# EAGLE board BMS_MCU (EAGLE 7.5.0)
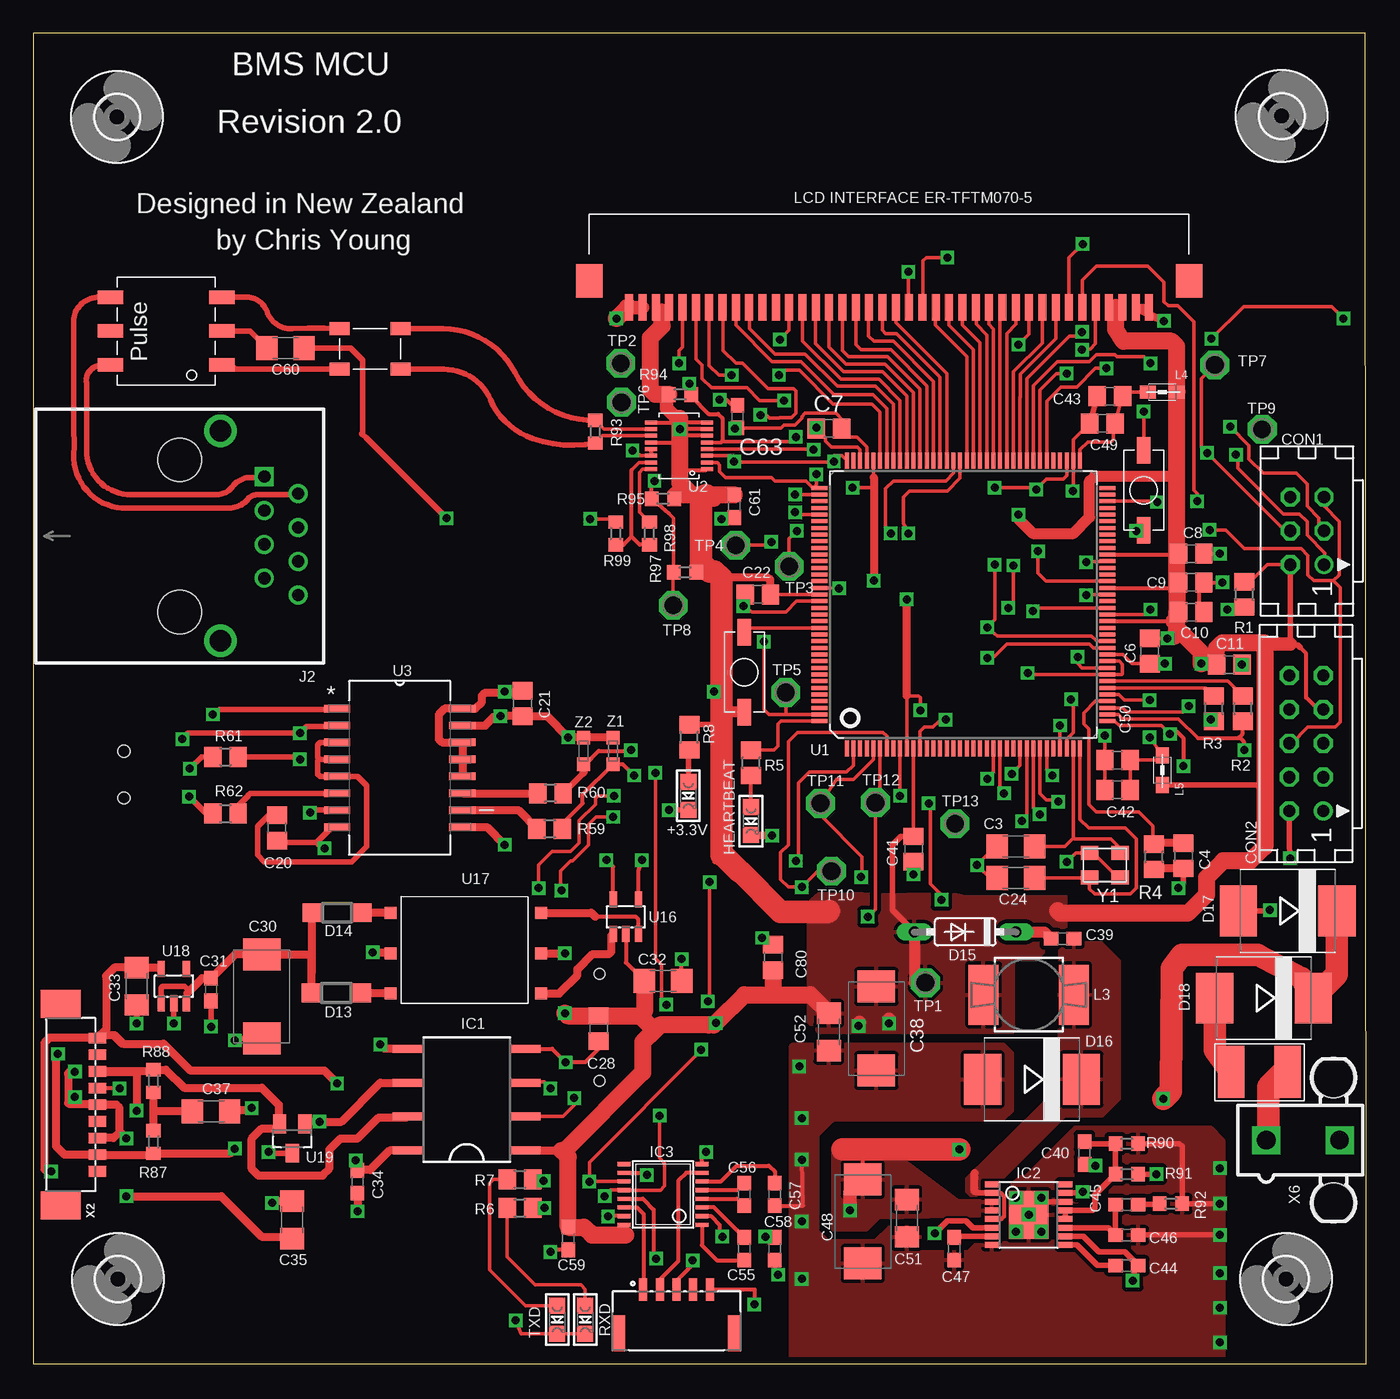
[diagram p2: board, top side]
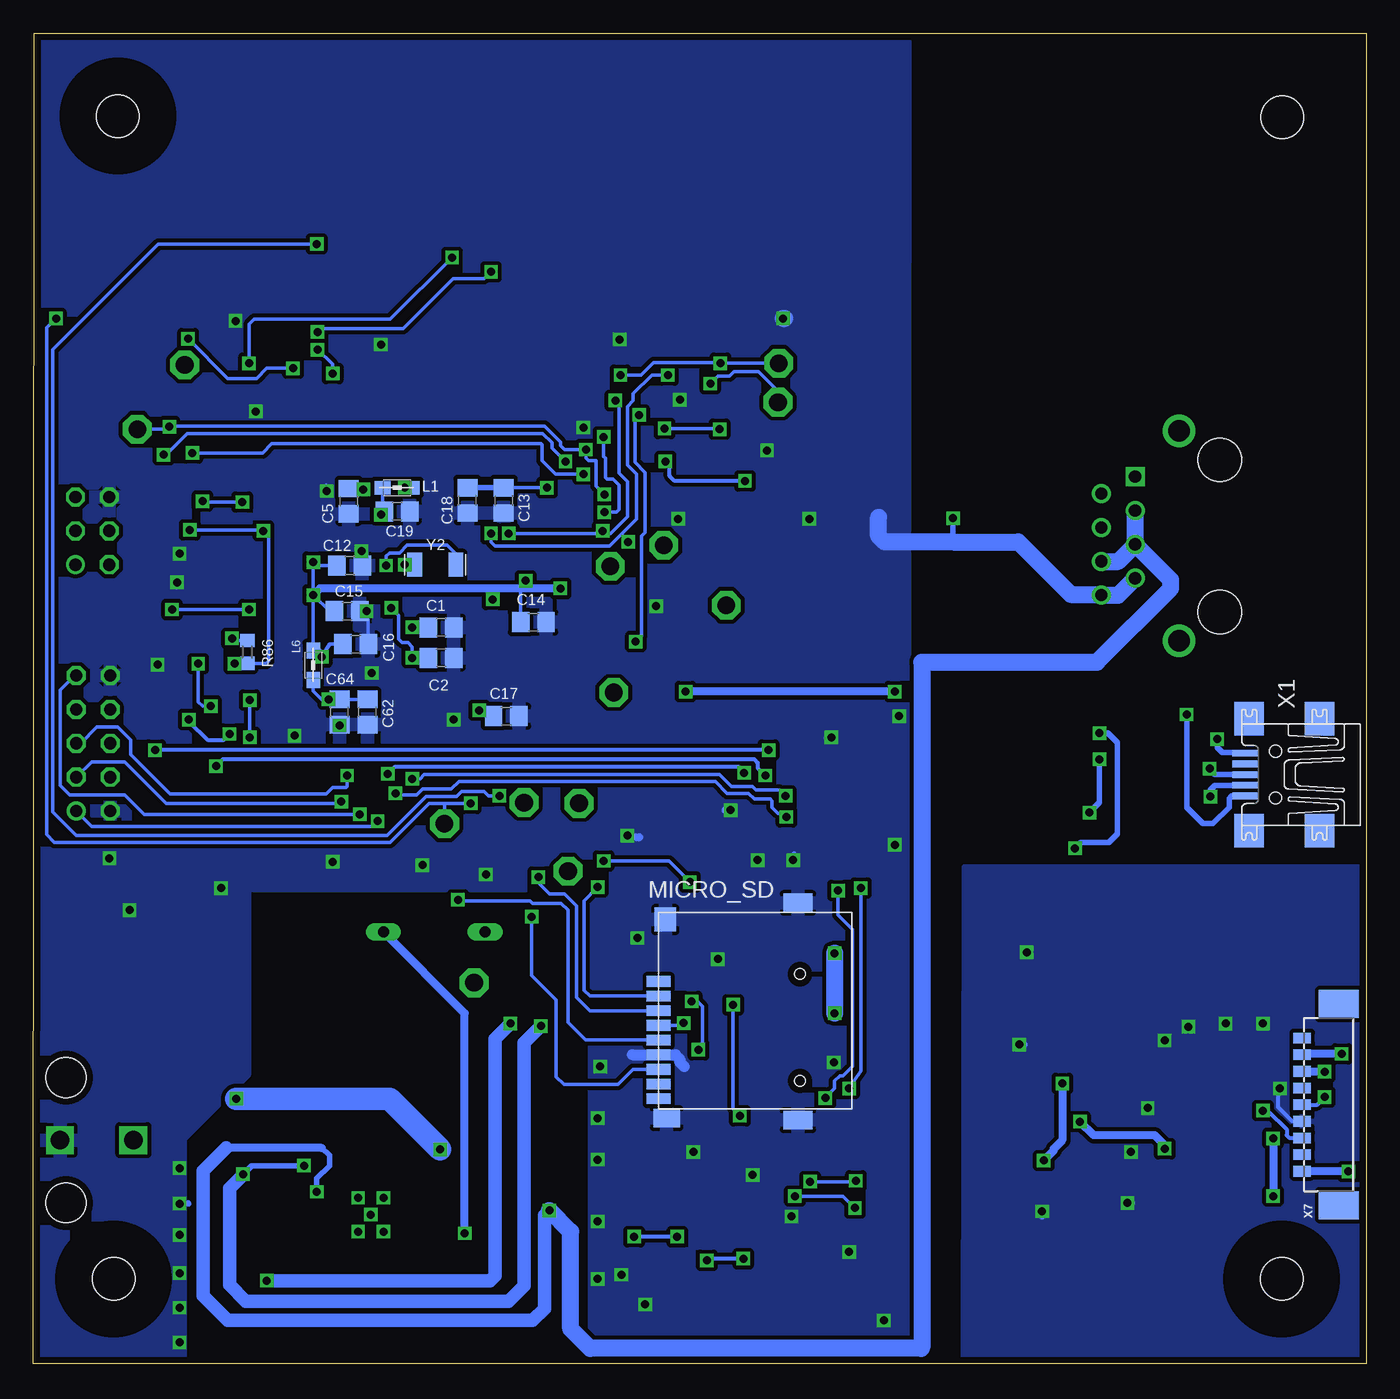
[diagram p3: board, bottom side, seen from below]

Size 100 x 99.81 mm. Coordinates in mm from the lower left corner, seen from the top.
Outline: 0,0 100,0 99.94,99.81 0,99.81 0,0
Copper layers (1*16): Top 0.035mm / dielectric 1.5mm / Bottom 0.035mm
Design rules "default *": minimum track width 6mil, minimum drill 12mil, track to track 6mil, track to pad 6mil, pad to pad 6mil, via to via 6mil, smd to smd 0mil, copper to edge 20mil, drill to drill 8mil, minimum pad ring 10mil, minimum via ring 8mil, stop-mask expansion 4mil, vias tented up to drill 0mil, thermal gap 10mil
Net classes: 0 default: drill 0.305 mm, clearance 0.152 mm; 1 POWER_12V: width 0.254 mm, drill 0.305 mm, clearance 0.152 mm to class 0, clearance 0.152 mm; 2 POWER_5V: width 0.254 mm, drill 0.305 mm, clearance 0.152 mm to class 0, clearance 0.152 mm to class 1, clearance 0.152 mm; 3 Ground: width 0.254 mm, drill 0.305 mm, clearance 0.152 mm to class 0, clearance 0.152 mm to class 1, clearance 0.152 mm to class 2, clearance 0.152 mm; 12 CAN_GND: clearance 0.381 mm to class 0, clearance 0.381 mm to class 1, clearance 0.381 mm to class 2, clearance 0.381 mm to class 3

## Footprints (pad centres in the part's own frame; a part is rotated, then mirrored left to right if it is on the bottom)
CHIPLED_0805 = smd 1.2 x 1.2: A 0,-1.05; C 0,1.05
C0805 = smd 1.3 x 1.5: 1 -0.95,0; 2 0.95,0
C1206 = smd 1.6 x 1.8: 1 -1.4,0; 2 1.4,0
SMC_D = smd 2.4 x 2.8: + -3.15,0; - 3.15,0
C0603 = smd 1.1 x 1: 1 -0.85,0; 2 0.85,0
C1206@1 = smd 1.6 x 1.8: 1 -1.4,0; 2 1.4,0
C0603@1 = smd 1.1 x 1: 1 -0.85,0; 2 0.85,0
CON06 = drill 0.914: 1 -2.54,-1.27 | drill 0.914 octagon: 2 -2.54,1.27; 3 0,-1.27; 4 0,1.27; 5 2.54,-1.27; 6 2.54,1.27
CON10 = drill 0.914: 1 -5.08,-1.27 | drill 0.914 octagon: 2 -5.08,1.27; 3 -2.54,-1.27; 4 -2.54,1.27; 5 0,-1.27; 6 0,1.27; 7 2.54,-1.27; 8 2.54,1.27; 9 5.08,-1.27; 10 5.08,1.27
SOD123 = smd 1.4 x 1.4: A 1.9,0; C -1.9,0
DO35-7 = drill 0.813 long: A 3.81,0; C -3.81,0
SMC = smd 2.8 x 3.8: A 3.7,0; C -3.7,0
PUCHBUTTON = smd 2 x 1: P$1 3,0; P$2 -3,0
1812 = smd 2 x 3.9: P$1 0,-0.03; P$2 4.25,-0.03
3,2 = hole 3.2: 0,0
DUB-R-PDSO-G8 = smd 0.6 x 2.2: 1 -3.81,-4.445; 2 -1.27,-4.445; 3 1.27,-4.445; 4 3.81,-4.445; 5 3.81,4.445; 6 1.27,4.445; 7 -1.27,4.445; 8 -3.81,4.445
TSSOP16EXP = smd 0.45 x 1.05: 1 -2.275,-2.768; 2 -1.625,-2.768; 3 -0.975,-2.768; 4 -0.325,-2.768; 5 0.325,-2.768; 6 0.975,-2.768; 7 1.625,-2.768; 8 2.275,-2.768; 9 2.275,2.768; 10 1.625,2.768; 11 0.975,2.768; 12 0.325,2.768; 13 -0.325,2.768; 14 -0.975,2.768; 15 -1.625,2.768; 16 -2.275,2.768 | smd 3.58 x 2.94: EXP 0,0
TSSOP16 = smd 0.305 x 0.991: 1 -2.275,-2.918; 2 -1.625,-2.918; 3 -0.975,-2.918; 4 -0.325,-2.918; 5 0.325,-2.918; 6 0.975,-2.918; 7 1.625,-2.918; 8 2.275,-2.918; 9 2.275,2.918; 10 1.625,2.918; 11 0.975,2.918; 12 0.325,2.918; 13 -0.325,2.918; 14 -0.975,2.918; 15 -1.625,2.918; 16 -2.275,2.918
J0-C/D/E = drill 0.914 square: 1 4.445,-6.35 | drill 0.914: 2 3.175,-8.89; 3 1.905,-6.35; 4 0.635,-8.89; 5 -0.635,-6.35; 6 -1.905,-8.89; 7 -3.175,-6.35; 8 -4.445,-8.89 | drill 1.626: S1 -7.874,-3.048; S2 7.874,-3.048 | hole 3.251: -5.715,0; 5.715,0
0805 = smd 1.2 x 1: 1 -1.1,0; 2 1.1,0
MS85 = smd 4.5 x 2.25: 1 0,-3.383; 2 0,3.383
MICROSD_PP = smd 1.8 x 0.8: 1 0,3.85; 2 0,2.75; 3 0,1.65; 4 0,0.55; 5 0,-0.55; 6 0,-1.65; 7 0,-2.75; 8 0,-3.85; 9 0,-4.95 | smd 1.6 x 1.8: GND@1 0.5,8.5 | smd 2.2 x 1.4: GND@2 10.45,9.75; GND@4 10.45,-6.55 | smd 2 x 1.4: GND@3 0.6,-6.4 | hole 0.8: 10.6,4.4; 10.6,-3.6
R0805 = smd 1.3 x 1.5: 1 -0.95,0; 2 0.95,0
R0603 = smd 1 x 1.1: 1 -0.85,0; 2 0.85,0
P1-13 = drill 1.321 pad 2.159 octagon: TP 0,0
LQFP144 = smd 0.3 x 1.2: 1 -8.75,-10.8; 2 -8.25,-10.8; 3 -7.75,-10.8; 4 -7.25,-10.8; 5 -6.75,-10.8; 6 -6.25,-10.8; 7 -5.75,-10.8; 8 -5.25,-10.8; 9 -4.75,-10.8; 10 -4.25,-10.8; 11 -3.75,-10.8; 12 -3.25,-10.8; 13 -2.75,-10.8; 14 -2.25,-10.8; 15 -1.75,-10.8; 16 -1.25,-10.8; 17 -0.75,-10.8; 18 -0.25,-10.8; 19 0.25,-10.8; 20 0.75,-10.8; 21 1.25,-10.8; 22 1.75,-10.8; 23 2.25,-10.8; 24 2.75,-10.8; 25 3.25,-10.8; 26 3.75,-10.8; 27 4.25,-10.8; 28 4.75,-10.8; 29 5.25,-10.8; 30 5.75,-10.8; 31 6.25,-10.8; 32 6.75,-10.8; 33 7.25,-10.8; 34 7.75,-10.8; 35 8.25,-10.8; 36 8.75,-10.8; 73 8.75,10.8; 74 8.25,10.8; 75 7.75,10.8; 76 7.25,10.8; 77 6.75,10.8; 78 6.25,10.8; 79 5.75,10.8; 80 5.25,10.8; 81 4.75,10.8; 82 4.25,10.8; 83 3.75,10.8; 84 3.25,10.8; 85 2.75,10.8; 86 2.25,10.8; 87 1.75,10.8; 88 1.25,10.8; 89 0.75,10.8; 90 0.25,10.8; 91 -0.25,10.8; 92 -0.75,10.8; 93 -1.25,10.8; 94 -1.75,10.8; 95 -2.25,10.8; 96 -2.75,10.8; 97 -3.25,10.8; 98 -3.75,10.8; 99 -4.25,10.8; 100 -4.75,10.8; 101 -5.25,10.8; 102 -5.75,10.8; 103 -6.25,10.8; 104 -6.75,10.8; 105 -7.25,10.8; 106 -7.75,10.8; 107 -8.25,10.8; 108 -8.75,10.8 | smd 1.2 x 0.3: 37 10.8,-8.75; 38 10.8,-8.25; 39 10.8,-7.75; 40 10.8,-7.25; 41 10.8,-6.75; 42 10.8,-6.25; 43 10.8,-5.75; 44 10.8,-5.25; 45 10.8,-4.75; 46 10.8,-4.25; 47 10.8,-3.75; 48 10.8,-3.25; 49 10.8,-2.75; 50 10.8,-2.25; 51 10.8,-1.75; 52 10.8,-1.25; 53 10.8,-0.75; 54 10.8,-0.25; 55 10.8,0.25; 56 10.8,0.75; 57 10.8,1.25; 58 10.8,1.75; 59 10.8,2.25; 60 10.8,2.75; 61 10.8,3.25; 62 10.8,3.75; 63 10.8,4.25; 64 10.8,4.75; 65 10.8,5.25; 66 10.8,5.75; 67 10.8,6.25; 68 10.8,6.75; 69 10.8,7.25; 70 10.8,7.75; 71 10.8,8.25; 72 10.8,8.75; 109 -10.8,8.75; 110 -10.8,8.25; 111 -10.8,7.75; 112 -10.8,7.25; 113 -10.8,6.75; 114 -10.8,6.25; 115 -10.8,5.75; 116 -10.8,5.25; 117 -10.8,4.75; 118 -10.8,4.25; 119 -10.8,3.75; 120 -10.8,3.25; 121 -10.8,2.75; 122 -10.8,2.25; 123 -10.8,1.75; 124 -10.8,1.25; 125 -10.8,0.75; 126 -10.8,0.25; 127 -10.8,-0.25; 128 -10.8,-0.75; 129 -10.8,-1.25; 130 -10.8,-1.75; 131 -10.8,-2.25; 132 -10.8,-2.75; 133 -10.8,-3.25; 134 -10.8,-3.75; 135 -10.8,-4.25; 136 -10.8,-4.75; 137 -10.8,-5.25; 138 -10.8,-5.75; 139 -10.8,-6.25; 140 -10.8,-6.75; 141 -10.8,-7.25; 142 -10.8,-7.75; 143 -10.8,-8.25; 144 -10.8,-8.75
MSOP16 = smd 0.305 x 0.889: P$1 0,0; P$2 0.5,0; P$3 1,0; P$4 1.5,0; P$5 2,0; P$6 2.5,0; P$7 3,0; P$8 3.5,0; P$9 3.5,4.2; P$10 3,4.2; P$11 2.5,4.2; P$12 2,4.2; P$13 1.5,4.2; P$14 1,4.2; P$15 0.5,4.2; P$16 0,4.2
SOIC127P1032X265-16N = smd 1.981 x 0.559: 1 -4.699,4.445; 2 -4.699,3.175; 3 -4.699,1.905; 4 -4.699,0.635; 5 -4.699,-0.635; 6 -4.699,-1.905; 7 -4.699,-3.175; 8 -4.699,-4.445; 9 4.699,-4.445; 10 4.699,-3.175; 11 4.699,-1.905; 12 4.699,-0.635; 13 4.699,0.635; 14 4.699,1.905; 15 4.699,3.175; 16 4.699,4.445
SOT23-DBV = smd 0.55 x 1.2: 1 -0.95,-1.3; 2 0,-1.3; 3 0.95,-1.3; 4 0.95,1.3; 5 -0.95,1.3
TSOT23-6_DDC = smd 0.9 x 0.9: 1 -3.03,-5.64; 2 0,-5.64; 3 3.03,-5.65; 4 3.03,5.65; 5 0,5.66; 6 -3.01,5.66
SOT23 = smd 1 x 1.4: 1 -0.95,-1.1; 2 0.95,-1.1; 3 0,1.1
DLW43S = smd 1 x 1.5: P$1 0,0; P$2 0,4.572; P$3 3.048,4.572; P$4 3.048,0
ER-CON40HB-2 = smd 2 x 0.6: P$1 0,0; P$2 0,-1; P$3 0,-2; P$4 0,-3; P$5 0,-4; P$6 0,-5; P$7 0,-6; P$8 0,-7; P$9 0,-8; P$10 0,-9; P$11 0,-10; P$12 0,-11; P$13 0,-12; P$14 0,-13; P$15 0,-14; P$16 0,-15; P$17 0,-16; P$18 0,-17; P$19 0,-18; P$20 0,-19; P$21 0,-20; P$22 0,-21; P$23 0,-22; P$24 0,-23; P$25 0,-24; P$26 0,-25; P$27 0,-26; P$28 0,-27; P$29 0,-28; P$30 0,-29; P$31 0,-30; P$32 0,-31; P$33 0,-32; P$34 0,-33; P$35 0,-34; P$36 0,-35; P$37 0,-36; P$38 0,-37; P$39 0,-38; P$40 0,-39 | smd 2.5 x 2: P$41 2,3; P$42 2,-42
T3001NL = smd 1.016 x 1.905: P$1 0,0; P$2 2.54,0; P$3 5.08,0; P$4 5.08,8.382; P$5 2.54,8.382; P$6 0,8.382
UX60-MB-5ST = smd 2 x 0.5: 1 2.25,1.6; 2 2.25,0.8; 3 2.25,0; 4 2.25,-0.8; 5 2.25,-1.6 | smd 2.2 x 2.5: M1 -3.3,-4.2; M2 -3.3,4.2; M3 2,4.2; M4 2,-4.2 | hole 0.9: 0,-1.75; 0,1.75
PB-53398-09 = smd 0.8 x 1.3: 1 -5,1.25; 2 -3.75,1.25; 3 -2.5,1.25; 4 -1.25,1.25; 5 0,1.25; 6 1.25,1.25; 7 2.5,1.25; 8 3.75,1.25; 9 5,1.25 | smd 2.1 x 3: PAD1 -7.55,-1.5; PAD2 7.55,-1.5
CM-502386-05 = smd 0.6 x 1.7: 1 2.5,-4.55; 2 1.25,-4.55; 3 0,-4.55; 4 -1.25,-4.55; 5 -2.5,-4.55 | smd 1 x 2.7: P1 4.35,-1.25; P2 -4.35,-1.25
5566-2 = drill 1.4 square: 1 0,-2.75; 2 0,2.75 | hole 3: 4.7,2.29; -4.7,2.29
CRYSTAL-3.2-2.5 = smd 1.3 x 1.05: 1 -1.15,-0.925; 2 1.15,-0.925; 3 1.15,0.925; 4 -1.15,0.925
ARDUINO_WIFI_SHIELD_V018_TG_RESONATOR_EPSON_FC_145 = smd 1.1 x 1.8: P$1 -1.55,0; P$2 1.55,0
CT/CN0603 = smd 1 x 1: 1 -1,0; 2 1,0

## Placement (x,y rotation side)
+3.3V  PWR  [CHIPLED_0805]  49.15,42.61 180 top
C1  22p  [C0805]  69.41,55.24 0 bottom
C2  22p  [C0805]  69.41,52.96 0 bottom
C3  22p  [C1206]  73.72,38.8 180 top
C4  22p  [C0805]  86.3,38.1 270 top
C5  0.1u  [C0805]  76.33,64.71 270 bottom
C6  0.01u  [C0805]  83.76,53.47 270 top
C7  10u  [C0805]  59.69,70.17 180 top
C8  0.1u  [C0805]  86.87,60.77 0 top
C9  0.1u  [C0805]  86.87,58.61 0 top
C10  0.1u  [C0805]  86.87,56.39 0 top
C11  0.1u  [C0805]  89.73,52.45 0 top
C12  10u  [C0805]  76.26,59.88 0 bottom
C13  0.1u  [C0805]  64.71,64.77 270 bottom
C14  0.1u  [C0805]  62.48,55.63 0 bottom
C15  0.1u  [C0805]  76.45,56.45 0 bottom
C16  0.1u  [C0805]  75.82,53.98 0 bottom
C17  0.1u  [C0805]  64.52,48.58 0 bottom
C18  0.1u  [C0805]  67.44,64.77 270 bottom
C19  0.1u  [C0805]  72.71,63.94 0 bottom
C20  0.1uF  [C0805]  18.29,40.2 270 top
C21  0.1uF  [C0805]  36.7,49.53 270 top
C22  0.1u  [C0805]  54.36,57.72 180 top
C24  22p  [C1206]  73.72,36.45 180 top
C28  0.1uF  [C0805]  42.42,25.15 270 top
C30  10uF  [SMC_D]  17.14,27.56 270 top
C31  0.1uF  [C0603]  13.34,28.07 270 top
C32  0.1uF  [C1206]  47.24,28.7 0 top
C33  0.1uF  [C1206]  7.75,28.32 270 top
C34  0.1uF  [C0603]  24.32,13.65 270 top
C35  4.7nF 2KV  [C1206]  19.43,10.79 270 top
C37  0.1uF  [C1206]  13.34,18.92 0 top
C38  100uF 10V  [SMC_D]  63.25,25.15 270 top
C39  0.68uF  [C0603]  77.22,31.88 0 top
C40  27pF  [C0603]  78.87,15.81 90 top
C41  0.1u  [C0805]  66.04,38.61 270 top
C42  0.1u  [C0805]  81.34,43.05 180 top
C43  0.1u  [C0805]  80.77,72.58 180 top
C44  0.1uF  [C0603]  82.04,7.37 0 top
C45  4700pF  [C0603]  82.04,11.94 0 top
C46  470pF  [C0603]  82.04,9.65 0 top
C47  1uF  [C0603]  69.09,8.64 270 top
C48  10uF  [SMC_D]  62.23,10.67 270 top
C49  10u  [C0805]  80.2,70.55 180 top
C50  10u  [C0805]  81.34,45.28 180 top
C51  4.7uF  [C1206]  65.53,10.92 270 top
C52  4.7uF  [C1206]  59.69,24.89 270 top
C55  0.1uF  [C0603]  53.34,8.64 90 top
C56  0.1uF  [C0603]  53.34,12.7 90 top
C57  0.1uF  [C0603]  55.63,12.7 270 top
C58  0.1uF  [C0603]  55.63,8.64 270 top
C59  0.1uF  [C0603]  40.13,9.4 270 top
C60  100pF  [C1206@1]  18.92,76.2 0 top
C61  100nF  [C0603@1]  52.58,64.33 270 top
C62  0.1u  [C0805]  74.93,48.9 270 bottom
C63  100nF  [C0603@1]  52.83,71.06 90 top
C64  10u  [C0805]  77.03,48.9 270 bottom
C80  0.1uF  [C0805]  55.5,30.48 90 top
CON1  SPI PROG  [CON06]  95.57,62.48 90 top
CON2  JTAG  [CON10]  95.5,46.55 90 top
D13  MBR0520LT  [SOD123]  22.73,27.81 0 top
D14  MBR0520LT  [SOD123]  22.8,33.85 0 top
D15  1N4148DO35-7  [DO35-7]  69.91,32.38 180 top
D16  MBRS340T3  [SMC]  74.93,21.34 180 top
D17  [SMC]  94.11,33.97 180 top
D18  S3D  [SMC]  92.33,27.43 180 top
ERASE  PUCHBUTTON  [PUCHBUTTON]  53.34,51.88 90 top
F1  LITTLEFUSE_PTC  [1812]  89.85,21.91 0 top
H1  MOUNT-HOLE3.2  [3,2]  93.98,6.35 0 top
H2  MOUNT-HOLE3.2  [3,2]  6.35,6.35 0 top
H3  MOUNT-HOLE3.2  [3,2]  93.66,93.6 0 top
H4  MOUNT-HOLE3.2  [3,2]  6.29,93.54 0 top
HEARTBEAT  HEARTBEAT  [CHIPLED_0805]  53.85,40.7 180 top
IC1  ISO1050DUB  [DUB-R-PDSO-G8]  32.51,19.81 90 top
IC2  LT3434  [TSSOP16EXP]  74.68,11.18 270 top
IC3  MAX3232CUE  [TSSOP16]  47.24,12.7 90 top
J2  J0006D21  [J0-C/D/E]  10.99,62.1 90 top
L1  MH2029-300Y  [0805]  72.71,65.72 0 bottom
L3  33uH  [MS85]  74.68,27.69 90 top
L4  MH2029-300Y  [0805]  84.71,72.9 180 top
L5  MH2029-300Y  [0805]  84.71,44.51 90 top
L6  MH2029-300Y  [0805]  78.99,52.39 270 bottom
MICRO_SD  MICRO_SD  [MICROSD_PP]  53.09,24.83 0 bottom
R1  100k  [R0805]  90.87,57.72 90 top
R2  39R 1%  [R0805]  90.74,49.15 90 top
R3  39R 1%  [R0805]  88.58,49.15 90 top
R4  6k8 1%  [R0805]  84.07,38.04 90 top
R5  402R  [R0805]  53.85,45.09 90 top
R6  1K  [R0805]  36.51,11.68 0 top
R7  1K  [R0805]  36.51,13.84 0 top
R8  1K  [R0805]  49.21,46.99 90 top
R59  24R  [R0805]  38.73,40.13 180 top
R60  24R  [R0805]  38.8,42.8 180 top
R61  24R  [R0805]  14.41,45.53 0 top
R62  24R  [R0805]  14.41,41.27 0 top
R86  100k  [R0603]  83.95,53.4 90 bottom
R87  60R  [R0603]  9.02,16.64 270 top
R88  60R  [R0603]  9.02,21.21 270 top
R90  100K  [R0603]  82.04,16.51 180 top
R91  195K  [R0603]  82.04,14.22 180 top
R92  10K  [R0603]  85.34,12 180 top
R93  120R  [R0603]  42.16,69.91 270 top
R94  4K7  [R0603]  48.51,72.71 180 top
R95  10K  [R0603]  47.24,64.9 0 top
R97  10k  [R0603]  48.9,59.37 0 top
R98  1k21  [R0603]  46.23,62.29 90 top
R99  808r  [R0603]  43.69,62.29 270 top
RESET  PUCHBUTTON  [PUCHBUTTON]  83.31,65.53 90 top
RXD  RX LED  [CHIPLED_0805]  41.4,3.3 180 top
TP1  PTR1PAD1-13  [P1-13]  66.93,28.57 0 top
TP2  PTR1PAD1-13  [P1-13]  44.07,75.06 0 top
TP3  PTR1PAD1-13  [P1-13]  56.71,59.82 0 top
TP4  PTR1PAD1-13  [P1-13]  52.7,61.4 0 top
TP5  PTR1PAD1-13  [P1-13]  56.45,50.36 0 top
TP6  PTR1PAD1-13  [P1-13]  44.13,72.14 0 top
TP7  PTR1PAD1-13  [P1-13]  88.65,74.93 0 top
TP8  PTR1PAD1-13  [P1-13]  48.01,56.9 0 top
TP9  PTR1PAD1-13  [P1-13]  92.2,70.1 0 top
TP10  PTR1PAD1-13  [P1-13]  59.88,36.96 0 top
TP11  PTR1PAD1-13  [P1-13]  59.05,42.04 0 top
TP12  PTR1PAD1-13  [P1-13]  63.18,42.1 0 top
TP13  PTR1PAD1-13  [P1-13]  69.15,40.51 0 top
TXD  TX LED  [CHIPLED_0805]  39.31,3.3 180 top
U1  ATSAM3X8EA-AU  [LQFP144]  69.79,56.96 0 top
U2  LTC6820  [MSOP16]  50.55,67.12 90 top
U3  ADUM4160BRWZ  [SOIC127P1032X265-16N]  27.5,44.7 0 top
U16  SN6501  [SOT23-DBV]  44.45,33.53 0 top
U17  WURTHWURTH  [TSOT23-6_DDC]  32.45,30.8 90 top
U18  TPS76350  [SOT23-DBV]  10.54,28.32 0 top
U19  SM712  [SOT23]  19.43,16.89 180 top
U$1  DLW43SH510XK2  [DLW43S]  22.99,77.66 270 top
U$2  ER-CON40HB-2  [ER-CON40HB-2]  44.7,79.25 90 top
U$4  T3001NL  [T3001NL]  14.16,74.93 90 top
X1  MINI-USB-UX60-MB-5ST  [UX60-MB-5ST]  6.79,44.2 180 bottom
X2  CAN IN  [PB-53398-09]  3.56,19.43 270 top
X5  RS232  [CM-502386-05]  48.26,1.02 180 top
X6  5566-2  [5566-2]  95.25,16.76 270 top
X7  CAN OUT  [PB-53398-09]  3.56,19.43 90 bottom
Y1  12MHz KX-7 20pF  [CRYSTAL-3.2-2.5]  80.39,37.4 0 top
Y2  32.768Khz  [ARDUINO_WIFI_SHIELD_V018_TG_RESONATOR_EPSON_FC_145]  69.85,59.94 0 bottom
Z1  CG0603MLC-05E  [CT/CN0603]  43.5,45.97 90 top
Z2  CG0603MLC-05E  [CT/CN0603]  41.27,45.97 90 top

## Tracks (layer width: path | path; a pad name or v marks a point on that pad's centre or on a via)
+3V3  (via drill 0.6)
  Top 0.254: C41.1 U1.11 | C22.1 58.97,57.72 U1.125 | U1.39 81.73,49.21 82.04,48.9 86.23,48.9 v86.68,49.34 | R1.2 91.31,58.67 92.58,59.94 CON1.2 | C10.1 85.79,56.39 | C6.1 v85.09,54.42 85.43,54.42 85.58,54.57 | 85.79,71.56 85.79,66.55 85.6,66.36 | 50.48,70.1 v48.51,70.1 48.53,70.12 U2.P$7 | v52.64,70.17 52.68,70.21 C63.1 56.11,70.21 56.33,70.42 57.15,70.42 57.66,70.93 57.66,71.06 57.91,71.31 60.2,71.31 60.79,70.72 C7.1 61.27,69.53 61.78,69.53 62.55,68.77 U1.105 | U$2.P$37 81.22,79.25 U$2.P$38 | v51.21,25.56 50.83,25.56 50.67,25.4 | v35.37,50.42 36.64,50.42 C21.1
  Top 0.305: U16.2 44.45,30.1 C32.1 | 44.45,9.65 44.45,10.3 IC3.16 | U2.P$8 48.71,70.62 48.64,70.55 48.51,70.42 | U2.P$7 48.72,70.12 48.51,69.91 | U2.P$6 48.55,69.62 48.51,69.66 | U2.P$9 48.46,70.62 48.51,70.67 | U2.P$12 48.29,69.12 48.51,68.9 | 48.51,67.06 50.48,67.06 U2.P$1 | C10.1 C9.1 C8.1 85.86,60.71 U1.62 | U1.57 85.62,58.21 85.79,58.04 | U1.52 85.58,55.71 85.79,56.13 | 86.55,49.21 v86.68,49.34 | CON2.7 96.39,49.09 95.5,49.97 95.5,53.28 95.06,53.72 | 47.18,78.87 47.32,78.87 U$2.P$4 | 47.12,78.93 47.02,78.93 U$2.P$3 | 50.1,60.07 50.1,59.73 R97.2
  Top 0.406: IC2.10 78.78,9.55 79.95,8.38 81.85,8.38 | 81.85,8.38 81.88,8.38 C44.2 | 81.85,8.38 82.61,7.62 82.61,6.35 v82.49,6.22 | R91.1 v84.26,14.22 | C40.1 79.59,14.96 v79.69,14.86 | 51.16,37.69 51.63,38.16 | 95.06,53.72 94.87,53.91 94.36,53.91 94.3,53.98 CON1.2 | C11.1 | C41.1 65.08,39.56 64.45,38.92 64.45,34.04 D15.A | 47.5,72.54 R94.2 | 48.18,65.17 48.18,64.98 R95.2 | L5.1 92.29,43.41 92.39,43.31 | R8.2 51.63,47.94 51.63,47.88
  Top 0.61: C22.1 55.31,58.8 55.18,58.93 55.12,58.93 55.05,58.99 51.69,58.99 51.63,58.93 | IC1.1 39.62,16 | v51.05,50.42 51.63,50.42 | C21.1 36.58,50.35 33.91,50.35 33.66,50.1 33.66,49.66 33.15,49.15 U3.16 30.86,49.15 30.42,48.7 30.42,46.86 30.67,46.61 U3.14 U3.13 U3.12 | U17.2 v39.88,30.8
  Top 0.813: D15.A 66.1,28.57 66.17,28.51 | C11.1 87.76,52.45 v87.63,52.51 | v73.91,63.69 73.91,63.37 74.99,62.29 78.04,62.29 79.25,63.5 79.25,66.23 79.63,66.61 85.34,66.61 85.6,66.36 | ERASE.P$2 51.86,48.88 51.63,48.64
  Top 1.016: v64.2,25.53 64.2,25.84 | v61.91,25.34 61.91,25.53 61.98,25.59 | 47.5,72.54 47.5,71.69 48.64,70.55 | 94.3,53.98 92.77,53.98 92.39,53.59
  Top 1.27: v39.88,26.29 40.07,26.1 C28.1 45.53,26.1 | 46.61,25.02 46.99,25.4 50.67,25.4 51.05,25.4 v51.21,25.56 53.34,27.69 55.63,27.69 | 46.61,25.02 45.72,24.13 45.72,21.84 39.88,16 39.62,16 40.13,15.49 C59.1 41.31,10.25 41.91,9.65 44.45,9.65 | 45.53,26.1 46.61,25.02 | 45.53,26.1 45.84,26.41 C32.1 | C61.1 50.8,65.17 | 49.19,65.17 48.18,65.17 | 51.05,64.92 50.8,65.17 | 50.8,65.17 50.48,65.17 49.19,65.17 | 49.19,65.17 49.02,65.34 49.02,65.6 48.51,66.1 48.51,67.06 48.51,68.9 48.51,69.66 48.51,69.91 v48.51,70.1 48.51,70.42 48.51,70.67 48.51,70.93 | 51.63,50.42 51.63,50.04 | 55.63,27.69 58.3,27.69 C52.1 | 51.63,38.16 51.69,38.16 | 85.79,56.13 85.79,56.39 85.79,58.04 85.79,71.56 85.79,72.88 L4.1 85.79,72.9 85.79,76.33 85.41,76.71 81.79,76.71 81.22,77.6 81.22,79.25 | v87.63,52.51 87.63,53.34 85.79,55.18 | 85.79,55.18 85.79,55.5 85.58,55.71 | 85.79,55.18 85.79,54.78 85.58,54.57 | C11.1 88.77,53.66 89.22,54.1 92.33,54.1 92.39,54.04 92.39,53.59 92.39,43.31 92.39,38.8 | 92.39,38.8 92.39,38.73 | 92.39,38.8 91.31,37.72 89.28,37.72 88.01,36.45 88.01,35.18 86.61,33.78 77.03,33.78 76.83,33.97 | 47.18,78.87 47.12,78.93 | C80.1 55.5,27.81 55.63,27.69 | R94.2 46.67,72.71 46.29,73.09 46.29,76.96 47.18,77.85 47.18,78.72 47.32,78.87
  Top 1.676: 50.48,65.17 50.1,64.79 50.1,60.07 50.74,59.44 51.12,59.44 51.63,58.93 51.63,50.04 51.63,48.64 51.63,47.88 51.63,38.23 51.69,38.16 | 51.63,38.16 51.75,38.16 53.02,36.89 53.09,36.89 56.07,33.91 59.63,33.91 59.69,33.97
  Bottom 0.254: v86.68,49.34 87.31,49.34 87.63,49.66 v87.63,52.51 | R86.2 84.93,54.25 v85.09,54.42 | L1.1 73.81,64.09 C19.1 | v52.64,70.17 48.58,70.17 v48.51,70.1 | MICRO_SD.4 51.39,25.38 v51.21,25.56
  Bottom 0.406: v79.69,14.86 83.63,14.86 v84.26,14.22
  Bottom 0.61: v35.37,50.42 v51.05,50.42
  Bottom 0.813: 73.81,64.09 73.81,63.8 v73.91,63.69
  Bottom 1.016: v82.49,6.22 65.72,6.22 65.34,6.6 65.34,24.38 v64.2,25.53 | v84.26,14.22 84.26,14.16 85.28,13.14 85.28,5.91 84.07,4.7 64.33,4.7 63.18,5.84 63.18,24.07 v61.91,25.34
  Bottom 1.27: v39.88,30.8 v39.88,26.29
  pour Top (isolate 0.305): 73.53,24.96 73.53,30.29 73.6,30.35 75.25,30.35 77.47,32.58 77.47,34.99 69.98,34.99 69.09,35.18 65.6,35.18 63.31,35.12 61.79,35.24 60.9,35.18 60.39,35.18 58.93,35.24 58.36,34.73 58.29,34.29 58.29,34.16 58.17,34.23 58.17,25.65 58.93,24.89 73.47,24.89
+12V  (via drill 0.6)
  Top 0.305: C48.+ 62.23,16 62.17,16.07
  Top 0.406: IC2.15 78.65,12.8 v78.74,12.89
  Top 1.016: v61.28,11.49 61.28,12.87 C48.+
  Top 1.27: 60.71,16.07 60.52,16.07
  Top 1.676: v84.77,19.88 85.34,20.45 85.41,29.65 86.17,30.67 91.89,30.67 95.12,28.96 D18.C 97.81,29.21 D17.C | v69.47,16.07 62.17,16.07 60.71,16.07
  Bottom 0.406: v78.74,12.89 78.74,13.91 77.79,14.86 77.79,15.62 78.36,16.19
  Bottom 0.61: 78.36,16.19 85.53,16.19 87.19,14.54
  Bottom 1.016: 85.53,16.19 87.25,14.48 87.25,5.08 85.41,3.24 62.55,3.24 61.66,4.13 61.66,11.11 v61.28,11.49
  Bottom 1.27: v61.28,11.49 59.69,9.91 59.69,2.6 58.23,1.14 33.4,1.14 33.34,1.21 33.34,52.64 20.19,52.64 14.67,58.17 14.67,58.8 J2.5 | J2.6 18.61,60.2 J2.5 | J2.5 J2.3
  Bottom 1.676: v84.77,19.88 73.28,19.88 v69.47,16.07
  pour Top: 60.01,15.88 60.01,10.1 62.55,10.1 63.44,10.99 72.9,11.18 72.9,12.19 69.41,12.19 64.39,15.94 60.07,15.94
+12V_UNPROTECTED
  Top 1.676: F1.P$2 94.17,22.28 92.65,20.77 92.65,16.91 X6.1
AVREF  (via drill 0.6)
  Top 0.254: U1.75 77.54,66.61 77.28,66.36 76.01,66.36 v75.25,65.6 75.12,65.72 v72.14,65.72
  Bottom 0.254: v75.25,65.6 76.27,65.6 C5.1 | L1.2 v72.14,65.72
BL_CTRL
  Top 0.254: U1.100 65.04,72.25 63.44,73.85 60.58,73.85 57.72,76.71 57.72,79.23 U$2.P$14
CAN_POWER  (via drill 0.6)
  Top 0.254: 5.46,25.02 5.39,25.02
  Top 0.61: U18.5 9.49,29.72 C33.1 6.1,29.72 5.46,29.08 5.46,25.02 | 4.5,24.51 X2.1 | 6.73,24 6.1,24.64 6.03,24.64 | 6.73,24 9.78,24 11.81,21.97 21.84,21.97 v22.8,21.02 | v24.19,15.24 24.19,14.63 C34.1 24.36,14.54 25.27,14.54 26.73,16 IC1.8 | 5.02,24.64 5.01,24.64 X2.1 | 5.39,25.02 X2.1 | 6.73,24 6.67,24 6.03,24.64 | 6.03,24.64 5.02,24.64 | 5.02,24.64 4.83,24.45 1.21,24.45 0.83,24.07 0.83,14.61 1.02,14.41 v1.33,14.41
  Bottom 0.61: v22.8,21.02 22.8,16.76 23.43,16.13 23.43,16 v24.19,15.24 | v1.33,14.41 4.79,14.41 X7.1
CANRX0  (via drill 0.6)
  Top 0.254: v43.5,41.02 42.23,41.02 41.66,40.45 41.66,38.92 40.45,37.72 40.32,37.72 39.56,36.96 39.56,35.56 v39.62,35.5 | v40.58,19.94 40.58,19.37 39.75,18.54 IC1.2 | U1.24 72.54,43.1 v72.83,42.8
  Bottom 0.254: v43.5,41.02 43.75,41.27 44.13,41.27 44.58,41.72 44.58,42.23 44.7,42.35 45.91,42.35 46.35,42.8 47.94,42.8 48.83,43.69 68.07,43.69 68.64,43.12 70.8,43.12 71.25,42.67 72.71,42.67 v72.83,42.8 | v39.62,35.5 39.62,33.66 38.54,32.58 38.54,22.29 39.24,21.59 39.5,21.59 39.88,21.21 39.88,20.64 v40.58,19.94
CANTX0  (via drill 0.6)
  Top 0.254: U1.23 72.04,44.35 v71.56,43.88 | v43.56,42.61 42.35,42.61 42.16,42.42 42.16,41.97 40.96,40.77 40.96,39.05 40.32,38.42 38.92,38.42 37.91,37.4 v37.91,35.69 | v38.8,20.64 38.35,21.14 37.02,21.14 IC1.3
  Bottom 0.254: v43.56,42.61 44.01,43.05 45.78,43.05 46.04,43.31 47.62,43.31 48.51,44.2 70.67,44.2 70.99,43.88 v71.56,43.88 | v37.91,35.69 37.91,21.97 v38.8,20.64
CTP_INT
  Top 0.254: U1.82 74.04,72.51 74.04,72.52 74.04,74.23 76.7,76.89 U$2.P$33
CTP_RST  (via drill 0.6)
  Top 0.254: U1.79 75.54,73.06 76.77,74.3 v77.53,74.3 | U$2.P$36 79.69,79.24 79.69,76.52 79.31,76.14 78.74,76.14 v78.68,76.07
  Bottom 0.254: v77.53,74.3 77.53,74.99 v78.68,76.07
CTP_SCL  (via drill 0.6)
  Top 0.254: U1.70 84.26,64.71 v84.33,64.64 | v87.31,64.71 87.31,65.28 87.06,65.53 87.06,78.17 85.85,79.38 85.15,79.38 84.84,79.69 84.84,81.15 83.63,82.36 79.76,82.36 78.7,81.31 U$2.P$35
  Bottom 0.254: v84.33,64.64 87.25,64.64 v87.31,64.71
CTP_SDA  (via drill 0.6)
  Top 0.254: U1.9 65.04,43.83 v65.02,42.61 | U$2.P$34 77.7,82.97 v78.74,84.01
  Bottom 0.254: v78.74,84.01 90.61,84.01 98.55,76.07 98.55,41.4 96.77,39.62 73.47,39.62 70.55,42.55 68.26,42.55 67.88,42.93 66.17,42.93 65.85,42.61 v65.02,42.61
CTP_WAKE
  Top 0.254: U$2.P$32 75.69,79.24 75.69,76.58 73.54,74.42 U1.83
D+  (via drill 0.6)
  Top 0.254: 80.57,48.2 81.15,48.2 81.47,47.88 84.64,47.88 v85.28,47.24
  Top 0.305: 80.57,48.2 U1.37 | v45.09,44.13 44.24,44.97 Z1.1 41.21,42.69 41.21,42.04 39.69,40.51 R59.1 | v86.3,44.83 86.3,46.93 85.63,47.59 v85.28,47.24 | R3.1 88.45,48.2 v88.33,48.32
  Bottom 0.305: v86.3,44.83 85.79,45.34 45.91,45.34 45.66,45.09 45.66,44.7 v45.09,44.13 | v88.33,48.32 88.33,48.2 86.93,46.8 85.72,46.8 v85.28,47.24
D-  (via drill 0.6)
  Top 0.254: U1.38 81.4,48.71 81.72,48.39 85.92,48.39 87.38,46.93
  Top 0.305: 90.74,48.01 R2.1 90.74,47.24 90.42,46.93 | Z2.1 41.42,44.97 42.42,45.97 45.09,45.97 v44.83,46.04 | 87.38,46.93 90.42,46.93 | 90.42,46.93 90.55,46.93 90.81,46.67 90.81,46.1 v90.87,46.04
  Top 0.406: R60.1 41.27,44.33
  Top 0.61: Z2.1 41.27,44.33
  Bottom 0.305: v44.83,46.04 v90.87,46.04 90.81,46.1
DB0
  Top 0.254: U1.99 65.54,72.58 63.69,74.42 60.77,74.42 58.67,76.52 58.67,79.22 U$2.P$15
DB1
  Top 0.254: U1.98 66.04,72.84 63.88,74.99 60.96,74.99 59.69,76.26 59.69,79.23 U$2.P$16
DB2
  Top 0.254: U1.97 66.54,73.1 64.07,75.56 61.15,75.56 60.71,76.01 U$2.P$17
DB3
  Top 0.254: U1.96 67.04,73.36 64.33,76.07 62.1,76.07 61.72,76.45 61.72,79.23 U$2.P$18
DB4
  Top 0.254: U1.95 67.54,73.69 64.52,76.71 63.06,76.71 62.67,77.09 62.67,79.22 U$2.P$19
DB5
  Top 0.254: U1.94 68.04,74.01 64.77,77.28 63.94,77.28 63.69,77.53 63.69,79.23 U$2.P$20
DB6
  Top 0.254: U1.93 68.54,74.28 64.71,78.11 U$2.P$21
DB7  (via drill 0.6)
  Top 0.254: U1.81 74.54,73.9 77.72,77.09 78.36,77.09 v78.68,77.41 | v65.66,81.92 65.66,79.29 U$2.P$22
  Bottom 0.254: v65.66,81.92 66.17,81.41 68.52,81.41 72.26,77.66 78.49,77.66 78.49,77.6 v78.68,77.41
DB8  (via drill 0.6)
  Top 0.254: U1.80 75.04,73.39 76.83,75.18 79.25,75.18 79.76,75.69 81.15,75.69 81.28,75.56 83.31,75.56 v83.82,75.06 83.69,75.18 | v68.58,83 66.99,83 66.74,82.74 66.74,79.28 U$2.P$23
  Bottom 0.254: v83.82,75.06 83.82,77.98 83.44,78.36 73.22,78.36 v68.58,83
DB9
  Top 0.254: U1.90 70.04,75.57 67.69,77.92 67.69,79.23 U$2.P$24
DB10
  Top 0.254: U1.89 70.54,76.08 68.71,77.92 U$2.P$25
DB11
  Top 0.254: U1.88 71.04,76.6 69.72,77.92 69.72,79.23 U$2.P$26
DB12
  Top 0.254: U1.87 71.54,77.18 70.74,77.98 70.74,79.21 U$2.P$27
DB13
  Top 0.254: U1.86 72.04,77.63 71.69,77.98 71.69,79.24 U$2.P$28
DB14
  Top 0.254: U1.85 72.54,79.08 U$2.P$29
DB15
  Top 0.254: U1.84 73.04,77.29 73.72,77.98 73.72,79.23 U$2.P$30
ERASE_S
  Top 0.254: U1.130 53.67,55.21 ERASE.P$1
GND  (via drill 0.6)
  Top 0.254: U2.P$14 45.55,68.12 v44.96,68.52 | U1.33 77.04,47.74 77.03,47.75 v77.03,47.88 | C22.2 53.41,56.89 v53.28,56.83 53.91,56.39 56.45,56.39 57.27,57.21 U1.126 | U1.106 62.04,68.58 61.85,68.77 59.88,68.77 59.44,69.22 59.44,69.47 C7.2 58.74,70.68 v58.74,70.23 | C42.2 C50.2 80.39,46.99 v80.39,47.12 | R4.1 84.58,37.09 85.79,37.09 | C24.2 71.75,36.45 v70.8,37.4 72.2,38.8 C3.2 | C41.2 v66.04,36.7 | U1.12 66.54,47.42 66.86,47.75 67.5,47.75 67.94,48.2 68.45,48.2 v68.45,48.32 | RESET.P$1 v83.31,71.44 | v77.98,65.47 78.04,65.98 U1.74 78.04,69.33 C49.2 | RXD.C TXD.C 36.6,2.25 v36.2,3.24 | v74.61,51.82 74.72,51.71 U1.44 81.68,51.71 81.72,51.75 81.72,52.45 81.47,52.71 U1.46 | U1.54 75.25,56.71 v74.99,56.45 | U1.58 75.97,58.71 75.37,59.31 v75.37,60.96 | U$2.P$13 56.7,77.53 v56.01,76.83 | U$2.P$31 74.7,77.24 v73.91,76.45 | C80.2 55.18,31.43 v54.67,31.94 | Y1.2 81.19,36.83 81.03,36.83 79.53,38.33 Y1.4 78.2,38.33 v77.53,37.66
  Top 0.305: U16.5 43.5,37.27 v42.99,37.78 | U16.4 45.4,36.95 v45.66,37.78 | C32.2 v48.64,30.35 | IC3.8 50.16,15.55 v50.48,15.88 | IC3.10 45.87,14.32 v46.04,14.16 | IC1.4 38.92,23.62 v39.94,22.61 41.4,22.61 42.42,23.62 C28.2 | C63.2 52.55,71.78 52.01,72.33 v51.5,72.33 | U2.P$13 U2.P$14 | 44.91,68.56 v44.96,68.52 | R99.1 43.73,63.33 v41.78,63.37 | C61.2 51.54,63.35 v51.63,63.37 | C57.2 57.75,11.85 v57.66,15.3 | C58.2 55.63,6.92 v55.88,6.67 | IC3.15 43.14,11.07 v43.12,11.05 | C59.2 38.97,8.55 v38.8,8.38 | X5.5 54.12,5.57 v54.1,4.45 | v75.63,9.91 v73.72,9.91 74.68,10.86 IC2.EXP | v73.72,12.45 v75.63,12.45 75.63,12.17 75.65,12.15 | C8.2 v89.03,60.77 | C9.2 v89.22,58.61 | C10.2 87.5,56.71 87.5,58.29 C9.2 | 87.72,58.71 C9.2 | C11.2 90.67,52.32 C11.2
  Top 0.406: IC2.14 75.65,12.15 IC2.EXP | C46.2 v89.03,9.65 | v89.03,12 R92.1 86.19,16.3 85.98,16.51 R90.1 | CON2.2 94.23,38.8 v94.3,37.91 | D17.A 92.71,33.97 v92.77,34.04 | C4.2 86.3,36.07 v85.92,35.69 | C43.2 C49.2 | +3.3V.C 48.13,41.56 v47.69,41.53 | 24.64,69.79 24.7,69.72 | v30.99,63.44 24.96,69.47 24.7,69.72 | C60.2 23.81,76.2 24.7,75.31 24.7,69.72
  Top 0.61: U3.9 34.04,40.26 v35.37,38.92 | U3.15 33.91,47.88 34.61,48.58 v35.05,48.58 C21.2 38.55,48.58 v40.13,46.99 40.15,46.97 Z2.2 Z1.2 | HEARTBEAT.C 54.2,39.65 v55.44,39.62 | C4.2 84.64,37.15 84.58,37.09 | U$2.P$40 U$2.P$39 v84.84,78.23
  Top 1.016: U$2.P$2 U$2.P$1
  Top 1.27: U$2.P$1 44.58,79.25 v43.75,78.42
  Bottom 0.254: v77.03,47.88 77.03,48.01 | v53.28,56.83 53.47,56.71 | v80.39,47.12 80.39,47.05 | v70.8,37.4 70.67,37.4 | v66.04,36.7 66.04,36.64 65.98,36.58 | v68.45,48.32 68.45,48.45 | C16.2 74.87,55.82 C15.2 v74.99,56.45 | v83.31,71.44 83.12,71.44 | v77.98,65.47 78.04,65.91 | v74.61,51.82 74.61,51.88 | v75.37,60.96 75.37,59.94 C12.2 | v56.01,76.83 56.01,76.71 | v73.91,76.45 73.85,76.52 | 55.05,23.18 55.12,23.11 | v54.67,31.94 54.67,32.13 | v77.53,37.66 77.41,37.66
  Bottom 0.305: v42.99,37.78 42.99,38.23 42.93,38.29 | v45.66,37.78 45.72,37.66 | v48.64,30.35 48.64,30.48 48.58,30.54 | v50.48,15.88 50.48,16 50.42,16.07 | v46.04,14.16 46.1,14.16 46.16,14.1 | v39.94,22.61 40.01,22.61 | v51.5,72.33 51.5,72.2 | v44.96,68.52 45.21,68.33 | v51.63,63.37 51.69,63.37 | v57.66,15.3 57.72,15.11 | v55.88,6.67 55.88,6.54 | v43.12,11.05 42.99,11.05 | v38.8,8.38 38.48,8.38 | v54.1,4.45 54.1,4.32 54.17,4.25 | v89.03,60.77 89.09,60.77 | v89.22,58.61 89.28,58.23 | C11.2 90.68,52.51 90.74,52.51
  Bottom 0.406: v89.03,9.65 89.09,9.53 89.03,9.59 | v89.03,12 88.33,12 88.39,12.06 | v94.3,37.91 94.3,37.97 | v85.92,35.69 85.92,35.5 | v47.69,41.53 47.5,41.53 47.94,41.59 48.13,41.59 48.13,41.47 | v30.99,63.44 30.99,61.66
  Bottom 0.61: v35.37,38.92 35.5,38.92 35.56,38.99 | v35.05,48.58 35.18,48.58 35.24,48.51 | v40.13,46.99 40.32,46.99 40.39,46.93 | v55.44,39.62 54.55,39.5
  Bottom 0.813: 51.18,22.29 51.5,22.61 51.5,22.86 51.82,23.18 MICRO_SD.6 55.05,23.18
  Bottom 1.27: v43.75,78.42 43.62,78.42 | 36.58,63.5 36.58,62.1 36.13,61.66 30.99,61.66 26.1,61.66 22.16,57.72 19.94,57.72 J2.8 18.61,57.66 J2.7
  other vias: 74.68,11.18 57.66,6.35 57.66,10.67 57.66,18.41 57.47,22.29 89.03,14.67 89.03,1.59 89.03,6.79 89.03,4.19 90.68,52.45
  pour Bottom (isolate 0.305): 34.73,0 34.61,99.12 99.95,99.19 99.95,0.19 88.96,0.19 88.96,16.95 84.14,21.78 84.14,35.88 59.44,35.88 57.91,34.35 57.91,0
  pour Top (isolate 0.305, rank 2): 58.67,23.94 72.77,23.94 73.41,23.3 73.41,18.99 72.71,18.29 60.01,18.29 58.8,17.08 58.8,9.97 59.56,9.21 63.18,9.21 64.26,10.29 66.17,10.29 66.48,9.97 66.48,8.57 66.67,8.38 70.17,8.38 70.8,9.02 72.83,9.02 73.03,9.21 73.03,10.29 73.47,10.73 73.47,13.46 74.04,14.03 74.49,14.03 78.17,17.72 88.33,17.72 89.28,16.76 89.28,0 57.28,0 56.83,0 56.83,23.75 56.9,23.81 56.9,23.88 56.96,23.94
GNDIO  (via drill 0.6)
  Top 0.254: 4.79,20.7 X2.4 4.72,20.77
  Top 0.305: v6.48,20.64 4.85,20.64 X2.4
  Top 0.406: C33.2 v7.75,25.53 | U18.2 v10.54,25.53 | C31.2 v13.34,25.27 | C30.- 15.52,24.41 15.37,24.26 v15.11,24.26 | C37.2 14.73,19.05 | U19.3 17.74,15.79 v17.65,15.88
  Top 0.61: C35.1 18.04,12.2 v17.91,12.06 | 14.73,19.05 16.26,19.05 v16.38,19.18 | IC1.5 26.35,23.62 v26.04,23.94 | C34.2 v24.32,11.43 | v25.46,30.86 26.73,30.86 U17.5
  Bottom 0.305: X7.4 5.54,18.18 6.6,19.24 6.6,20.51 v6.48,20.64
  Bottom 0.406: v7.75,25.53 7.75,25.27 | v13.34,25.27 13.34,25.02 | v15.11,24.26 14.86,24.26 | v17.65,15.88 17.4,15.88
  Bottom 0.61: v17.91,12.06 17.65,12.06 | v25.46,30.86 25.27,30.86 | v26.04,23.94 25.72,23.94 | v24.32,11.43 24.32,11.11
  pour Bottom (isolate 0.305): 0.06,37.27 30.16,37.27 30.23,0 0,0
HEARTBEAT
  Top 0.254: U1.144 56.08,48.21 55.88,48.01 55.88,46.35 55.56,46.04 R5.2
INT
  Top 0.254: U1.101 64.54,71.99 63.18,73.34 60.33,73.34 57.91,75.75 55.63,75.75 53.72,77.66 53.72,79.23 U$2.P$10
LCD_CS  (via drill 0.6)
  Top 0.254: U1.103 63.54,71.4 62.93,72.01 60.01,72.01 57.47,74.55 56.33,74.55 v55.94,74.17 | v48.45,75.06 48.45,76.01 48.7,76.26 U$2.P$5
  Bottom 0.254: v55.94,74.17 54.42,74.17 53.47,75.12 48.51,75.12 v48.45,75.06 TP2.TP
LTC6820_ENABLE  (via drill 0.6)
  Top 0.254: U2.P$5 51.63,69.12 51.69,69.18 | 51.69,69.25 51.69,69.18 | 51.69,69.18 56.86,69.18 v57.21,69.53 | U1.113 57.15,63.71 v57.15,63.88 | v49.21,73.53 49.34,72.99 R94.1
  Top 0.305: R94.1 49.36,72.56 50.67,71.25 51.37,71.25 51.69,70.93 51.69,69.25
  Bottom 0.254: v57.21,69.53 57.21,68.07 57.09,67.94 57.09,66.48 56.96,66.36 56.52,66.36 56.07,65.91 56.07,64.07 56.26,63.88 v57.15,63.88 | TP6.TP 44.13,72.96 45.59,74.42 47.43,74.42 47.75,74.11 48.64,74.11 v49.21,73.53
MASTER-RESET  (via drill 0.6)
  Top 0.254: U1.47 81.73,53.21 82.42,52.51 83.88,52.51 C6.2 83.89,52.51 v84.9,52.51 | CON1.5 96.84,64.33 97.98,63.18 97.98,59.18 97.54,58.74 | 97.54,58.74 96.08,58.74 95.63,59.18 95.63,60.64 95.12,61.15 90.87,61.15 89.47,62.55 v88.27,62.55 | RESET.P$2 82.79,62.53 v82.74,62.48 | CON2.6 94.42,46.55 95.63,47.75 97.66,47.75 98.04,48.13 98.04,58.23 97.54,58.74
  Bottom 0.254: R86.1 84.86,52.55 v84.9,52.51 82.55,52.51 82.36,52.7 82.36,62.1 v82.74,62.48 82.8,62.55 v88.27,62.55
MISO  (via drill 0.6)
  Top 0.254: U2.P$3 52.34,68.12 52.39,68.07 52.39,67.75 52.51,67.75 v52.58,67.69 | v90.23,68.2 90.36,68.07 90.36,67.18 93.79,63.75 95,63.75 95.57,63.18 95.57,62.17 96.9,60.83 96.9,60.01 CON1.1 | 47.69,63.79 48.05,63.44 R97.1 48.01,59.33 TP8.TP | v52.58,67.69 52.58,68.07 52.51,68.14 | U1.108 60.66,68.14 60.07,68.14 v60.07,67.69 60.01,67.69 59.94,67.63 52.64,67.63 v52.58,67.69
  Top 0.305: v46.61,66.23 46.39,66.02 R95.1 47.69,63.79
  Bottom 0.254: v90.23,68.2 90.04,68.2 88.46,69.79 61.78,69.79 61.09,69.09 61.09,68.71 v60.07,67.69
  Bottom 0.305: v46.61,66.23 51.88,66.23 52.26,66.61 52.26,67.69 v52.58,67.69
MISO1  (via drill 0.6)
  Top 0.254: U1.6 63.54,42.84 TP12.TP 63.18,34.1 v62.61,33.53
  Bottom 0.254: v62.61,33.53 62.61,29.15 60.77,27.3 60.77,21.53 60.2,20.95 56.13,20.95 55.01,22.08 MICRO_SD.7
MOSI  (via drill 0.6)
  Top 0.254: U2.P$2 51.32,67.62 51.5,67.44 51.5,66.93 51.94,66.48 55.37,66.48 55.63,66.23 57.96,66.23 58.48,65.71 | U1.109 58.48,65.71 | CON1.4 93.92,62.48 v88.08,68.33 87.63,68.77 87.63,73.91 TP7.TP | v58.74,66.74 58.74,65.96 58.48,65.71
  Bottom 0.254: v88.08,68.33 82.8,68.33 82.11,69.03 61.91,69.03 61.85,68.96 61.85,67.75 60.83,66.74 v58.74,66.74
MOSI1  (via drill 0.6)
  Top 0.254: U1.5 63.04,45.32 61.53,43.81 60.26,43.81 TP11.TP 59.12,42.55 59.12,41.08 62.17,38.04 62.17,36.58 v62.1,36.51
  Bottom 0.254: v62.1,36.51 62.1,36.07 61.28,35.24 60.13,35.24 59.24,34.35 59.24,27.5 58.23,26.48 MICRO_SD.3
N$1
  Top 0.406: U$4.P$1 14.86,74.93 15.18,74.61 U$1.P$4
N$2
  Top 0.406: U$4.P$3 16,80.01 arc-71 17.53,78.93 arc74 19.43,77.66 arc-6 U$1.P$1
N$3
  Top 0.406: R8.1 49.15,46.04 +3.3V.A
N$4
  Top 0.406: U$4.P$4 4.95,80.01 arc103 3.05,77.85 | 3.05,77.85 3.05,69.79 arc-5 3.05,68.26 arc89 6.67,64.2 14.67,64.2 arc49 16.07,64.83 arc-45 16.83,65.22 19.81,65.22 J2.2 | 3.05,77.85 3.05,77.92
N$5
  Top 0.406: U$4.P$6 4.95,74.87 arc97 4,73.6 4,68.52 arc85 7.05,65.22 13.78,65.22 arc53 14.92,65.79 arc-59 16.51,66.48 17.27,66.48 J2.1
N$7
  Top 0.305: HEARTBEAT.A R5.1
N$8
  Top 0.406: C20.1 17.65,41.15 16.83,40.32 16.83,38.16 17.34,37.66 23.88,37.66 25.02,38.8 25.02,43.37 24.32,44.07 U3.5 21.53,44.07 21.4,44.2 21.34,44.2 21.34,45.21 21.46,45.34 | U3.3 21.53,46.61 21.34,46.42 21.34,45.47 21.46,45.34 | 21.46,45.34 U3.4
N$9
  Top 0.61: U17.1 39.45,27.77 40.83,29.15 40.83,29.59 41.97,30.73 43.18,30.73 43.37,30.92 43.37,32.1 U16.1
N$10
  Top 0.61: D13.A 26.76,27.81 U17.6
N$11
  Top 0.406: R62.2 15.36,41.84 16.13,42.61 16.13,42.67 16.26,42.8 U3.6
N$12  (via drill 0.6)
  Top 0.406: R61.2 19.81,45.53 v20,45.34 | v20.77,41.34 20.77,41.47 20.83,41.53 U3.7
  Bottom 0.406: v20,45.34 20,42.1 v20.77,41.34
N$13
  Top 0.254: RXD.A 41.4,5.59 41.08,5.91 37.66,5.91 35.56,8 R6.1
N$14
  Top 0.254: TXD.A 36.92,4.35 34.23,7.05 34.23,13.53 34.54,13.84 R7.1
N$26
  Top 0.406: 11.56,27.81 11.56,27.09 U18.3 | U18.1 9.59,28.2 9.72,28.32 11.37,28.32 11.72,27.97
  Top 0.61: 11.56,27.81 11.72,27.97 12.66,28.92 C31.1 15.13,30.71 C30.+ 20.86,30.71 D13.C 20.9,30.67 D14.C
N$29
  Top 0.61: D14.A 26.78,33.85 U17.4
N$42
  Top 0.61: U3.10 36.39,41.53 R59.2
N$45
  Top 0.61: U3.11 R60.2
N$47
  Top 0.254: U2.P$11 42.72,69.62 R93.2
  Top 0.406: U$1.P$3 30.8,74.61 arc-66 34.29,72.33 arc48 37.47,69.41 arc29 R93.2
  Top 0.61: R93.2 41.81,69.06
N$53
  Top 0.254: U1.43 89.63,51.21 R2.2
N$54  (via drill 0.6)
  Top 0.61: v15.11,16.13 14.77,15.79 R87.2 8.91,15.68 X2.8 2.35,15.68 1.71,16.32 1.71,23.11 v1.84,23.24 | U19.1 20.55,18.16 v21.46,18.16 23.11,18.16 26.04,21.08 IC1.6
  Bottom 0.61: v15.11,16.13 15.11,16.38 15.88,17.14 20.45,17.14 v21.46,18.16 | v1.84,23.24 4.75,23.24 X7.8
N$55  (via drill 0.6)
  Top 0.254: 4.78,21.91 X2.3
  Top 0.61: IC1.7 28,18.48 25.91,18.48 24.32,16.89 23.05,16.89 22.23,16.07 22.23,14.67 21.72,14.16 21.72,14.1 16.89,14.1 16.38,14.61 16.38,16.89 17.14,17.65 18.14,17.65 U19.2 18.41,18.06 18.41,19.43 17.14,20.7 11.3,20.7 9.95,22.06 R88.1 8.89,21.93 X2.3 | 4.78,21.91 7.62,21.91 7.75,21.78 v7.75,18.99
  Bottom 0.305: v7.75,18.99 7.37,18.99 5.97,17.59 5.97,17.14 5.78,16.95 4.83,16.95 X7.3
N$56
  Top 0.254: U1.42 87.97,50.71 R3.2
N$59  (via drill 0.6)
  Top 0.254: U1.53 83.45,56.21 v83.82,56.58 | v89.6,56.58 90.67,56.58 R1.1
  Bottom 0.254: v83.82,56.58 v89.6,56.58
N$61
  Top 0.406: IC2.12 IC2.13 79.45,11.5 79.63,11.68 79.63,12.66 R91.2 R90.2 79.02,16.51 C40.2
N$62
  Top 0.305: IC3.1 50.16,8.89 51.31,7.75 53.3,7.75 C55.1
N$63
  Top 0.305: C55.2 53.32,9.49 51.05,11.75 50.18,11.75 IC3.3
N$73
  Top 0.305: IC3.4 52.81,12.38 C56.1
N$108
  Top 0.254: U2.P$10 42.81,70.12 R93.1
  Top 0.406: 42.14,70.74 R93.1 arc-64 36.13,74.36 arc63 30.73,77.66 U$1.P$2
N$114
  Top 0.406: 17.46,76.26 C60.1 16.25,77.47 U$4.P$2
N$115
  Top 0.305: IC3.5 52.81,13.03 C56.2
N$118
  Top 0.305: U16.3 45.4,33.34 45.21,33.53 42.16,33.53
  Top 0.61: U17.3 41.86,33.83 42.16,33.53
N$128
  Top 0.305: IC3.6 51.58,13.68 52.77,14.86 55.18,14.86 55.63,14.41 C57.1
N$129
  Top 0.61: R87.1 9.02,18.92 | 9.02,18.92 R88.2 | C37.1 9.02,18.92
N$130  (via drill 0.6)
  Top 0.406: IC2.6 70.51,10.2 69.98,10.73 68.58,10.73 v67.63,9.78
  Top 0.813: D15.C 75.86,32.38 C39.1
  Bottom 0.61: v67.63,9.78 67.63,26.29 D15.C
N$131
  Top 0.406: IC2.9 78.28,8.9 79.82,7.37 C44.1
N$132
  Top 0.305: IC2.2 72.61,12.8 72.83,12.57 72.83,11.05 72.64,10.86 IC2.5
  Top 0.406: IC2.2 70.77,12.8 70.61,12.95
  Top 0.61: 70.61,12.95 70.61,14.29
  pour Top (rank 2): 70.04,12.89 70.04,13.91 76.96,20.64 77.03,30.99 77.72,31.56 80.14,31.56 81.47,30.23 81.47,19.88 80.2,18.61 77.41,18.61 72.83,14.03 71.18,14.03 70.93,13.78 70.93,12.83 70.74,12.64 70.29,12.64
N$133
  Top 0.406: IC2.7 69.15,9.55 C47.1
N$134
  Top 0.406: C45.1 C46.1 80.64,10.2 IC2.11
N$135
  Top 0.406: C45.2 84.43,11.94 R92.2
N$136
  Top 1.676: D18.A 88.63,23.55 F1.P$1
N$137
  Top 0.305: IC3.14 45.3,11.72 45.78,11.24 45.78,5.08 X5.1
N$138
  Top 0.305: IC3.7 49,14.32 48.39,13.72 48.39,7.68 46.99,6.29 46.99,5.08 X5.2
N$139  (via drill 0.6)
  Top 0.305: IC3.13 45.73,12.38 46.55,11.56 46.55,8.06 v46.74,7.87 | v49.47,7.75 49.47,7.43 48.26,6.22 X5.3
  Bottom 0.305: v46.74,7.87 49.34,7.87 v49.47,7.75
N$147  (via drill 0.6)
  Top 0.305: IC3.2 50.84,11.07 51.5,10.41 51.5,9.72 v51.69,9.53 | v54.93,9.53 55.59,9.53 C58.1
  Bottom 0.305: v51.69,9.53 v54.93,9.53
N$150
  Top 0.254: U2.P$15 45.46,67.62 44.9,67.06
  Top 0.305: R99.2 44.3,61.44 44.9,62.04 | 44.9,62.04 44.9,67.06 | R98.1 45.49,61.44 44.9,62.04
N$151
  Top 0.254: U2.P$16 45.72,67.12 45.47,66.86 45.47,63.91 R98.2
  Top 0.305: U2.P$16 46.16,67.12
PE  (via drill 0.6)
  Top 0.254: 4.72,17.02 X2.7
  Top 0.305: X7.5 3.17,19.43 3.11,19.49 v3.11,20
  Top 0.61: 6.48,17.4 6.01,16.93 X2.7 | 6.48,17.4 6.48,19.18 6.22,19.43 X7.5 4.74,19.49 3.11,19.49 2.67,19.49 2.6,19.56 2.6,21.78 2.73,21.91 v3.11,21.91 | 6.48,17.4 v6.99,16.89 | v6.99,12.57 14.1,12.57 17.14,9.53 19.3,9.53 C35.2
  Bottom 0.305: X7.5 3.68,19.43 v3.11,20
  Bottom 0.61: v6.99,16.89 v6.99,12.57 | X7.7 3.13,21.93 v3.11,21.91
RX0  (via drill 0.6)
  Top 0.254: v42.86,12.57 43.31,13.03 IC3.12 47.05,13.02 47.37,13.34 47.37,15.05 46.99,15.43 v46.99,18.61 | v38.35,11.68 R6.2 | U1.27 74.04,44.89 v73.41,44.26 | v46.67,44.32 46.67,30.42 47.12,29.97 47.12,27.11 v47.5,26.92
  Bottom 0.254: v42.86,12.57 39.24,12.57 v38.35,11.68 | v47.5,26.92 47.5,19.11 v46.99,18.61
  Bottom 0.305: v46.67,44.32 46.67,44.39 47.05,44.77 72.9,44.77 v73.41,44.26
SCLK  (via drill 0.6)
  Top 0.254: U2.P$4 58.51,68.62 v58.55,68.58 | v89.79,70.29 91.19,68.9 91.19,67.88 92.27,66.8 94.74,66.8 95.57,65.98 95.57,64.33 96.46,63.44 96.46,62.87 CON1.3 | v57.15,65.22 U1.110
  Bottom 0.254: v57.15,65.22 57.78,65.85 57.78,67.75 58.36,67.75 58.55,67.94 v58.55,68.58 | v58.55,68.58 58.55,68.14 | v58.55,68.58 60.13,68.58 60.45,68.9 60.45,69.15 61.66,70.36 89.72,70.36 v89.79,70.29 89.98,70.1 TP9.TP
SCLK1  (via drill 0.6)
  Top 0.254: U1.78 76.04,72.23 77.09,73.28 78.3,73.28 79.69,74.68 v80.52,74.68 | v88.39,76.9 90.81,79.31 97.41,79.31 v98.3,78.42 | v68.14,34.8 68.14,35.18 67.31,36.01 67.31,41.91 v67.18,42.04
  Bottom 0.254: v80.52,74.68 82.49,74.68 83.25,73.91 85.41,73.91 v88.39,76.9 | MICRO_SD.5 58.57,24.28 59.88,25.59 59.88,34.04 60.39,34.54 62.55,34.54 62.74,34.73 68.07,34.73 v68.14,34.8 | v98.3,78.42 99,77.72 99,39.69 98.42,39.12 73.22,39.12 70.29,42.04 69.15,42.04 | v67.18,42.04 69.15,42.04 | TP13.TP 69.15,42.04
SPI1_CS  (via drill 0.6)
  Top 0.254: U1.7 64.04,47.09 63.75,47.37 57.34,47.37 56.64,46.67 56.64,38.92 56.07,38.35 56.07,36.32 56.64,35.75 v57.66,35.75 58.86,36.96 TP10.TP
  Bottom 0.254: MICRO_SD.2 58.25,27.58 58.67,28 58.67,34.73 v57.66,35.75
SPI2_MISO  (via drill 0.6)
  Top 0.254: U1.91 69.54,66.42 68.58,65.47 65.72,65.47 65.28,65.02 65.28,63.06 v65.66,62.29 | U$2.P$7 50.7,74.9 51.44,74.17 v52.39,74.17 | TP4.TP 55.12,61.4 v55.37,61.66
  Bottom 0.254: v65.66,62.29 65.66,61.66 65.34,61.34 56.77,61.34 55.88,62.23 | 55.88,62.23 54.74,63.37 54.74,66.74 55.44,67.44 55.44,71.82 54.99,72.26 54.99,72.77 53.59,74.17 v52.39,74.17 | v55.37,61.66 55.37,61.72 55.88,62.23
SPI2_MOSI  (via drill 0.6)
  Top 0.254: U1.92 69.04,66.81 68.45,66.23 64.52,66.23 63.94,65.66 63.94,62.74 v64.33,62.29 | U$2.P$6 49.72,79.23 49.72,75.37 50.16,74.93 50.16,73.91 50.86,73.22 53.53,73.22 54.48,72.26 v56.33,72.26 | TP3.TP 56.71,61.91 v57.28,62.48
  Bottom 0.254: v64.33,62.29 57.09,62.29 | v56.33,72.26 56.07,72.01 56.07,66.8 55.44,66.17 55.44,63.56 56.71,62.29 57.09,62.29 | 57.09,62.29 v57.28,62.48
SPI2_SCLK  (via drill 0.6)
  Top 0.254: U1.143 56.45,48.71 | 56.45,48.71 55.18,48.71 54.8,49.09 v54.8,54.17 | v54.55,71.18 54.99,71.18 55.24,70.93 55.94,70.93 56.01,70.99 56.9,70.99 57.21,71.31 57.21,72.96 57.02,73.15 55.12,73.15 53.21,75.06 52.7,75.06 51.75,76.01 51.75,79.2 U$2.P$8 | TP5.TP 56.45,48.71
  Bottom 0.254: v54.55,71.18 54.86,70.87 54.86,67.63 54.1,66.86 54.1,62.36 54.36,62.1 54.36,54.61 v54.8,54.17
TCK  (via drill 0.6)
  Top 0.254: U1.28 74.54,40.84 v74.17,40.7
  Bottom 0.254: CON2.1 95.63,40.32 74.55,40.32 v74.17,40.7
TDI  (via drill 0.6)
  Top 0.254: U1.29 75.04,41.68 v75.5,41.21
  Bottom 0.254: v75.5,41.21 91.69,41.21 93.15,42.67 97.28,42.67 97.98,43.37 97.98,50.55 96.9,51.63 CON2.9
TDO  (via drill 0.6)
  Top 0.254: U1.30 75.54,42.76 76.01,42.29 76.77,42.29 v76.9,42.16
  Bottom 0.254: CON2.3 95.63,45.15 93.15,45.15 90.04,42.04 77.03,42.04 v76.9,42.16
TMS  (via drill 0.6)
  Top 0.254: U1.31 76.04,44.55 v76.45,44.13
  Bottom 0.254: CON2.5 96.46,46.55 95.25,47.75 93.66,47.75 92.71,46.8 92.71,45.72 89.72,42.74 78.04,42.74 77.53,43.24 76.52,43.24 76.45,43.31 v76.45,44.13
TX0  (via drill 0.6)
  Top 0.254: IC3.11 41.74,13.68 v41.72,13.65 41.72,15.11 50.1,23.5 v50.1,23.56 | v38.29,13.72 37.59,13.72 R7.2 | v50.74,36.13 50.74,27.3 v50.61,27.18 | v57.21,37.72 57.21,37.78 57.4,37.97 57.4,43.56 58.23,44.39 61.02,44.39 61.53,44.9 U1.2
  Bottom 0.254: v41.72,13.65 38.35,13.65 v38.29,13.72 | v57.21,37.72 52.32,37.72 v50.74,36.13 | v50.61,27.18 50.16,27.18 49.78,26.8 49.78,24.13 v50.1,23.56
USB_D+  (via drill 0.6)
  Top 0.406: R61.1 12.64,45.53 v11.75,44.64
  Bottom 0.406: v11.75,44.64 11.75,44.58 11.37,44.2 X1.3
USB_D-  (via drill 0.6)
  Top 0.406: R62.1 12.95,41.27 v11.68,42.55
  Bottom 0.406: v11.68,42.55 11.68,43.05 11.37,43.37 9.07,43.37 X1.2
USB_GND  (via drill 0.6)
  Top 0.406: U3.8 22.42,40.26 21.27,39.12 | 21.27,39.12 18.42,39.12 C20.2 | U3.2 22.73,47.82 20.51,47.82 v20,47.31 11.62,47.31 v11.18,46.86 | v21.84,38.67 21.72,38.67 21.27,39.12
  Bottom 0.406: v20,47.31 19.37,47.31 18.67,46.61 18.67,39.75 19.3,39.12 21.4,39.12 v21.84,38.67 | v11.18,46.86 11.18,46.23 10.79,45.85 9.1,45.85 X1.5
USB_VCC  (via drill 0.6)
  Top 0.406: v13.46,48.7 13.53,48.7 13.78,48.96 13.84,48.96 13.97,49.09 22.73,49.09 U3.1
  Bottom 0.406: v13.46,48.7 13.46,41.72 12.26,40.51 11.49,40.51 10.29,41.72 10.29,42.42 10.11,42.6 X1.1
VBG
  Top 0.254: U1.40 79.68,49.71 78.8,48.83 78.8,48.01 79.18,47.62 79.18,41.97 79.76,41.4 82.93,41.4 84.01,40.33 84.01,39.05 R4.2
  Top 0.61: C4.1 84.14,39.05 R4.2
VDDANA
  Top 0.254: U1.73 78.54,68.57 79.12,69.15 80.83,69.15 81.03,69.34 81.03,70.42 C49.1 C43.1 81.4,72.9 L4.2
VDDOUT  (via drill 0.6)
  Top 0.254: v78.99,60.13 79.06,60.13 79.12,60.2 80.58,60.2 U1.61 | v78.99,57.66 79.06,57.66 79.12,57.72 80.58,57.72 U1.56 | v78.36,53.02 78.36,52.51 78.68,52.2 80.57,52.2 U1.45 | U1.124 60.41,58.21 v60.45,58.17 | U1.104 63.04,66.5 63.06,66.48 | U1.10 65.54,50.1 | 65.54,50.1 65.53,50.1 | v61.47,65.72 63.06,65.72 | v66.55,49.02 66.55,49.97 66.42,50.1 65.54,50.1
  Top 0.61: 63.06,66.48 63.06,65.72 v63.06,58.74 | 65.53,50.1 v65.53,57.34
  Bottom 0.254: v78.99,57.66 v78.99,60.13 78.74,59.88 C12.1 | v78.99,57.66 L6.1 78.44,53.49 v78.36,53.02 77.79,53.98 C16.1 | C15.1 77.79,56.45 v78.99,57.66 | C14.1 63.43,58.36 v63.06,58.74 | C13.1 v61.47,65.72 | C17.1 66.1,48.58 v66.55,49.02
  Bottom 0.406: C13.1 C18.1
  Bottom 0.61: v60.45,58.17 63.06,58.17 | 63.06,58.17 65.53,58.17 | 65.53,58.17 78.49,58.17 v78.99,57.66 | v63.06,58.74 63.06,58.17 | v65.53,57.34 65.53,58.17
VDDOUTMI  (via drill 0.6)
  Top 0.254: v83.76,46.99 83.82,46.95 L5.2 84.37,45.28 C50.1 C42.1 | U1.41 81.43,50.21 81.85,49.78 v83.76,49.78
  Bottom 0.254: v83.76,49.78 v83.76,46.99
VDDPLL  (via drill 0.6)
  Top 0.254: U1.34 77.54,46.87 78.04,47.37 78.04,49.66 v77.85,49.85
  Bottom 0.254: C62.1 C64.1 v77.85,49.85 78.36,49.85 78.99,50.48 L6.2
WAIT
  Top 0.254: U1.102 64.04,71.66 62.99,72.71 60.07,72.71 57.59,75.18 55.44,75.18 52.7,77.92 U$2.P$9
XIN
  Top 0.254: C24.1 79.21,36.45 Y1.1 79.25,35.62 79.63,35.24 82.3,35.24 82.74,35.69 82.74,39.37 81.92,40.2 79.18,40.2 78.54,40.84 U1.36
XIN32  (via drill 0.6)
  Top 0.254: U1.48 79.51,53.71 79.25,53.98 73.03,53.98 72.01,52.96 v71.56,52.96 | v73.53,59.88 73.53,57.09 v73.15,56.71
  Bottom 0.254: C2.1 v71.56,52.96 71.56,53.78 71.88,54.1 72.33,54.1 72.58,54.36 72.58,56.13 v73.15,56.71 | Y2.P$2 68.3,60.74 68.96,61.4 71.94,61.4 72.52,60.83 73.28,60.83 73.53,60.58 v73.53,59.88 73.34,60.07
XOUT
  Top 0.254: U1.35 78.04,39.43 | C3.1 77.4,38.8 78.04,39.43 | Y1.3 81.54,38.66 80.83,39.37 78.1,39.37 78.04,39.43
XOUT32  (via drill 0.6)
  Top 0.254: U1.49 79.78,54.21 79.38,54.61 72.33,54.61 v71.56,55.24 72.14,55.82 v72.14,59.94
  Bottom 0.254: v71.56,55.24 C1.1 | Y2.P$1 v72.14,59.94

## Text on the board
tPlace: BMS MCU | Revision 2.0 | Designed in New Zealand | LCD INTERFACE ER-TFTM070-5 | by Chris Young